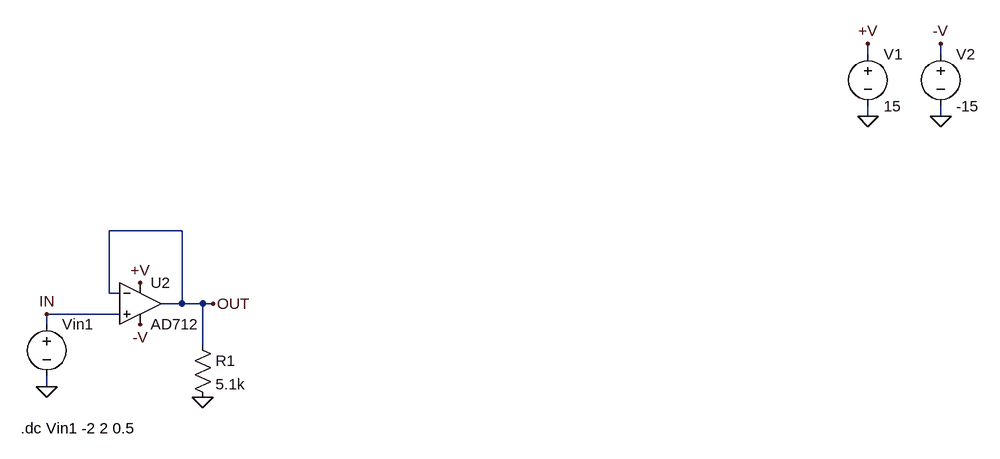
[diagram p0: schematic ProportionalSummingCircuit.asc]
* ProportionalSummingCircuit.asc
V1 +V 0 15
Vin1 IN 0
V2 -V 0 -15
* U2: AD712 (symbol AD712 not available, pins judged from their places): In+=IN In-=OUT V+=+V V-=-V OUT=OUT
R1 OUT 0 5.1k
.dc Vin1 -2 2 0.5
.backanno
.end

* Results of the author's LTspice run, read from the files saved beside the schematic
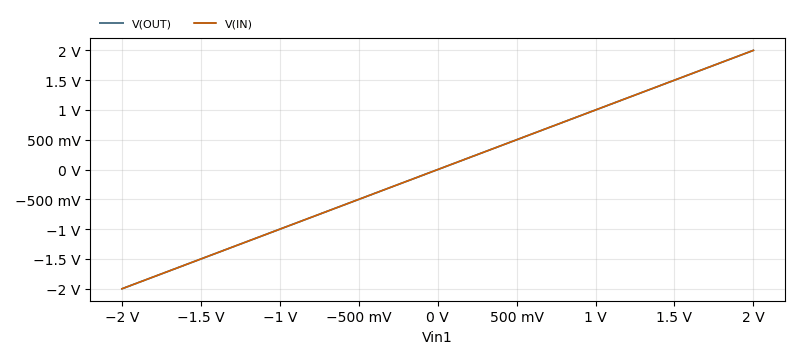
[diagram p1: DC transfer characteristic of ProportionalSummingCircuit.asc, plotted from the saved traces]
* DC transfer characteristic, 1 run:
*   V(OUT): -2 V at Vin1=-2 V, 2 V at Vin1=2 V, min -2 V, max 2 V
*   V(IN): -2 V at Vin1=-2 V, 2 V at Vin1=2 V, min -2 V, max 2 V